# Altium schematic sheet DB36_Top.SchDoc: DB36 Top Level
size A4; Organization: Altium Limited.; Address1: Level 3, 12a Rodborough Rd; Address2: Frenchs Forest 2086; Address3: NSW; Address4: AUSTRALIA; DocumentNumber: 1; SheetNumber: 2; SheetTotal: 23
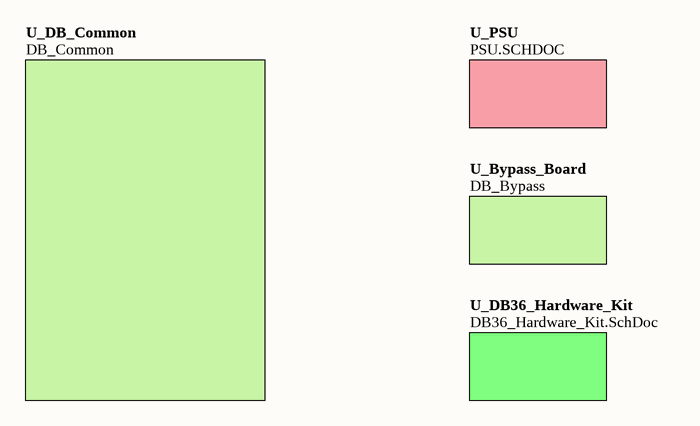
[diagram p0: DB36_Top.SchDoc]

## Sub-sheets
U_Bypass_Board = DB_Bypass: no entries
U_DB36_Hardware_Kit = DB36_Hardware_Kit.SchDoc: no entries
U_DB_Common = DB_Common: no entries
U_PSU = PSU.SCHDOC: no entries

## Notes on the sheet
- Sheet Title
- Project Title
- Size:
- Date:
- A4
- Assy:
- Time:
- Revision:
- Sheet
- of
- File: